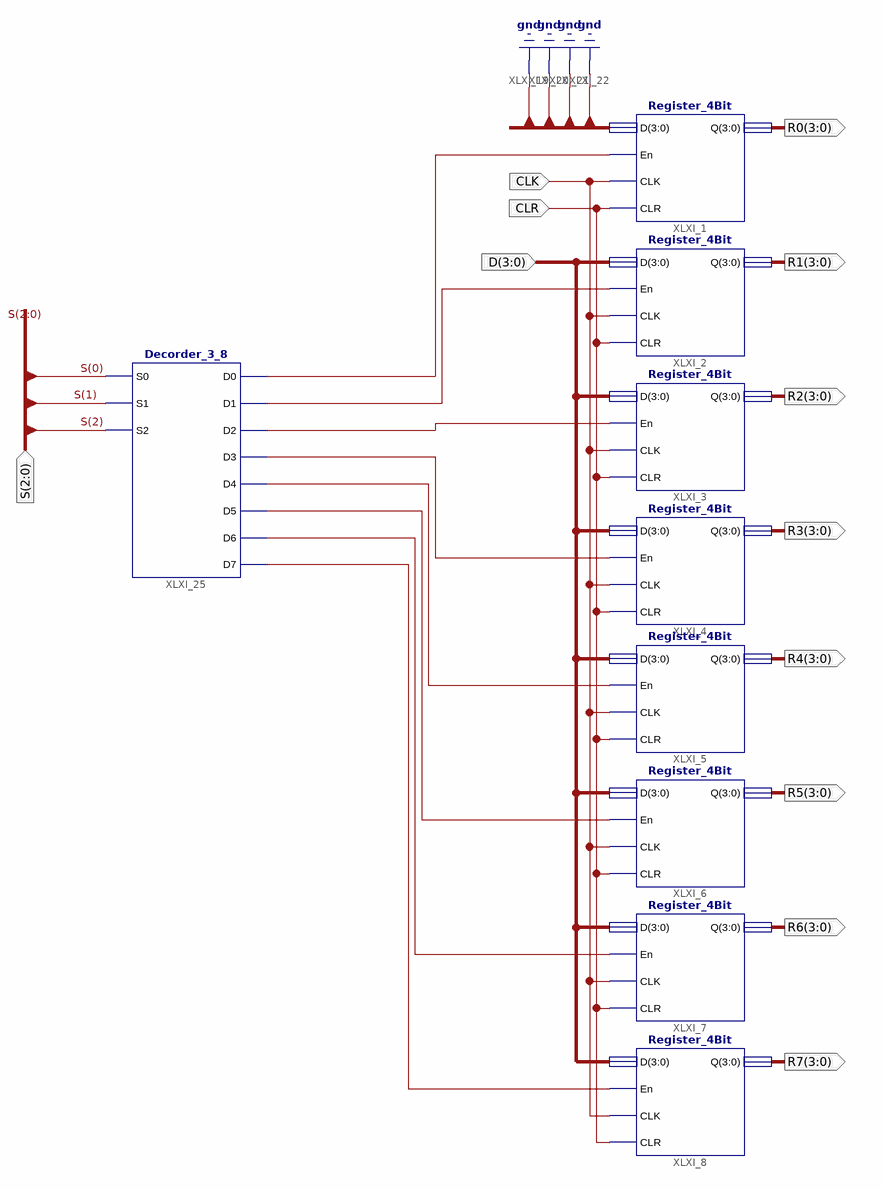
[diagram p0: schematic sheet 1]
// Xilinx ISE schematic Reg_8_4bit.sch (spartan3e) as structural Verilog: 9 symbols, 12 ports
module Reg_8_4bit (
  input  CLK,
  input  CLR,
  input  [3:0] D,
  input  [2:0] S,
  output [3:0] R0,
  output [3:0] R1,
  output [3:0] R2,
  output [3:0] R3,
  output [3:0] R4,
  output [3:0] R5,
  output [3:0] R6,
  output [3:0] R7
);

  wire XLXN_49, XLXN_50, XLXN_51, XLXN_52, XLXN_53, XLXN_54, XLXN_55, XLXN_56;

  Register_4Bit XLXI_1 (.CLK(CLK), .CLR(CLR), .D(4'b0000), .En(XLXN_49), .Q(R0));
  Register_4Bit XLXI_2 (.CLK(CLK), .CLR(CLR), .D(D), .En(XLXN_50), .Q(R1));
  Register_4Bit XLXI_3 (.CLK(CLK), .CLR(CLR), .D(D), .En(XLXN_51), .Q(R2));
  Register_4Bit XLXI_4 (.CLK(CLK), .CLR(CLR), .D(D), .En(XLXN_52), .Q(R3));
  Register_4Bit XLXI_5 (.CLK(CLK), .CLR(CLR), .D(D), .En(XLXN_53), .Q(R4));
  Register_4Bit XLXI_6 (.CLK(CLK), .CLR(CLR), .D(D), .En(XLXN_54), .Q(R5));
  Register_4Bit XLXI_7 (.CLK(CLK), .CLR(CLR), .D(D), .En(XLXN_55), .Q(R6));
  Register_4Bit XLXI_8 (.CLK(CLK), .CLR(CLR), .D(D), .En(XLXN_56), .Q(R7));
  Decorder_3_8 XLXI_25 (
    .D0(XLXN_49), .D1(XLXN_50), .D2(XLXN_51), .D3(XLXN_52), .D4(XLXN_53), .D5(XLXN_54), .D6(XLXN_55),
    .D7(XLXN_56), .S0(S[0]), .S1(S[1]), .S2(S[2]));
endmodule
